# Altium schematic sheet st-link-v2.SchDoc
size C
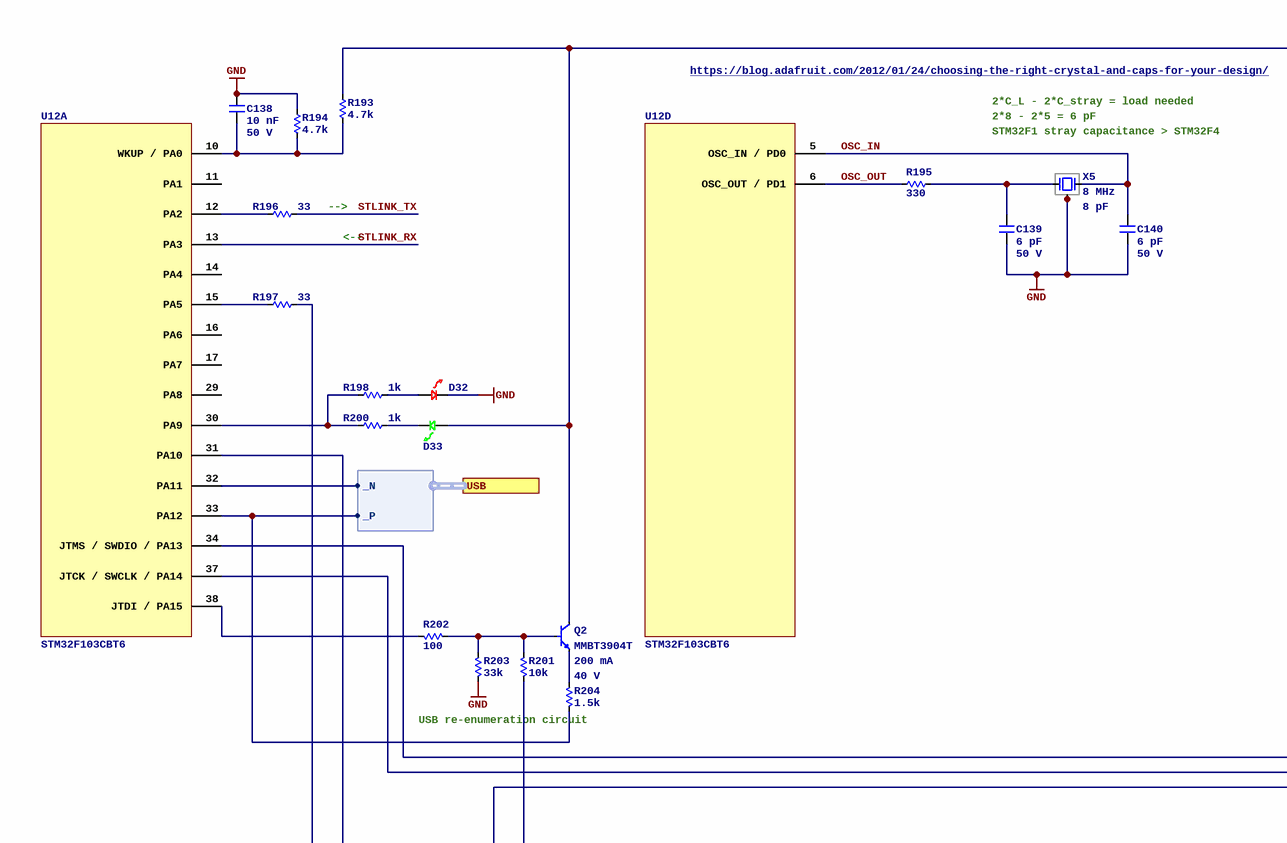
[diagram p0: st-link-v2.SchDoc, top left]
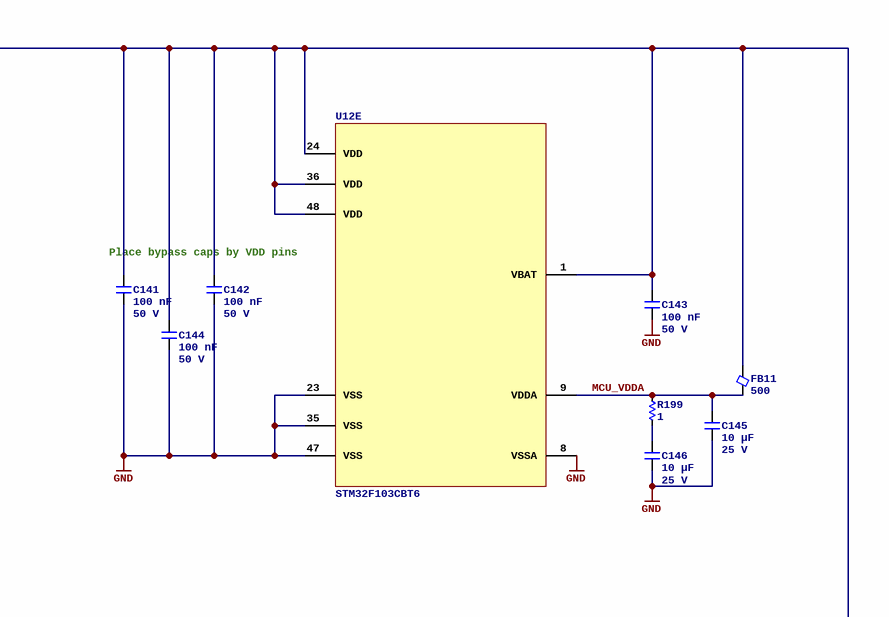
[diagram p1: st-link-v2.SchDoc, top right]
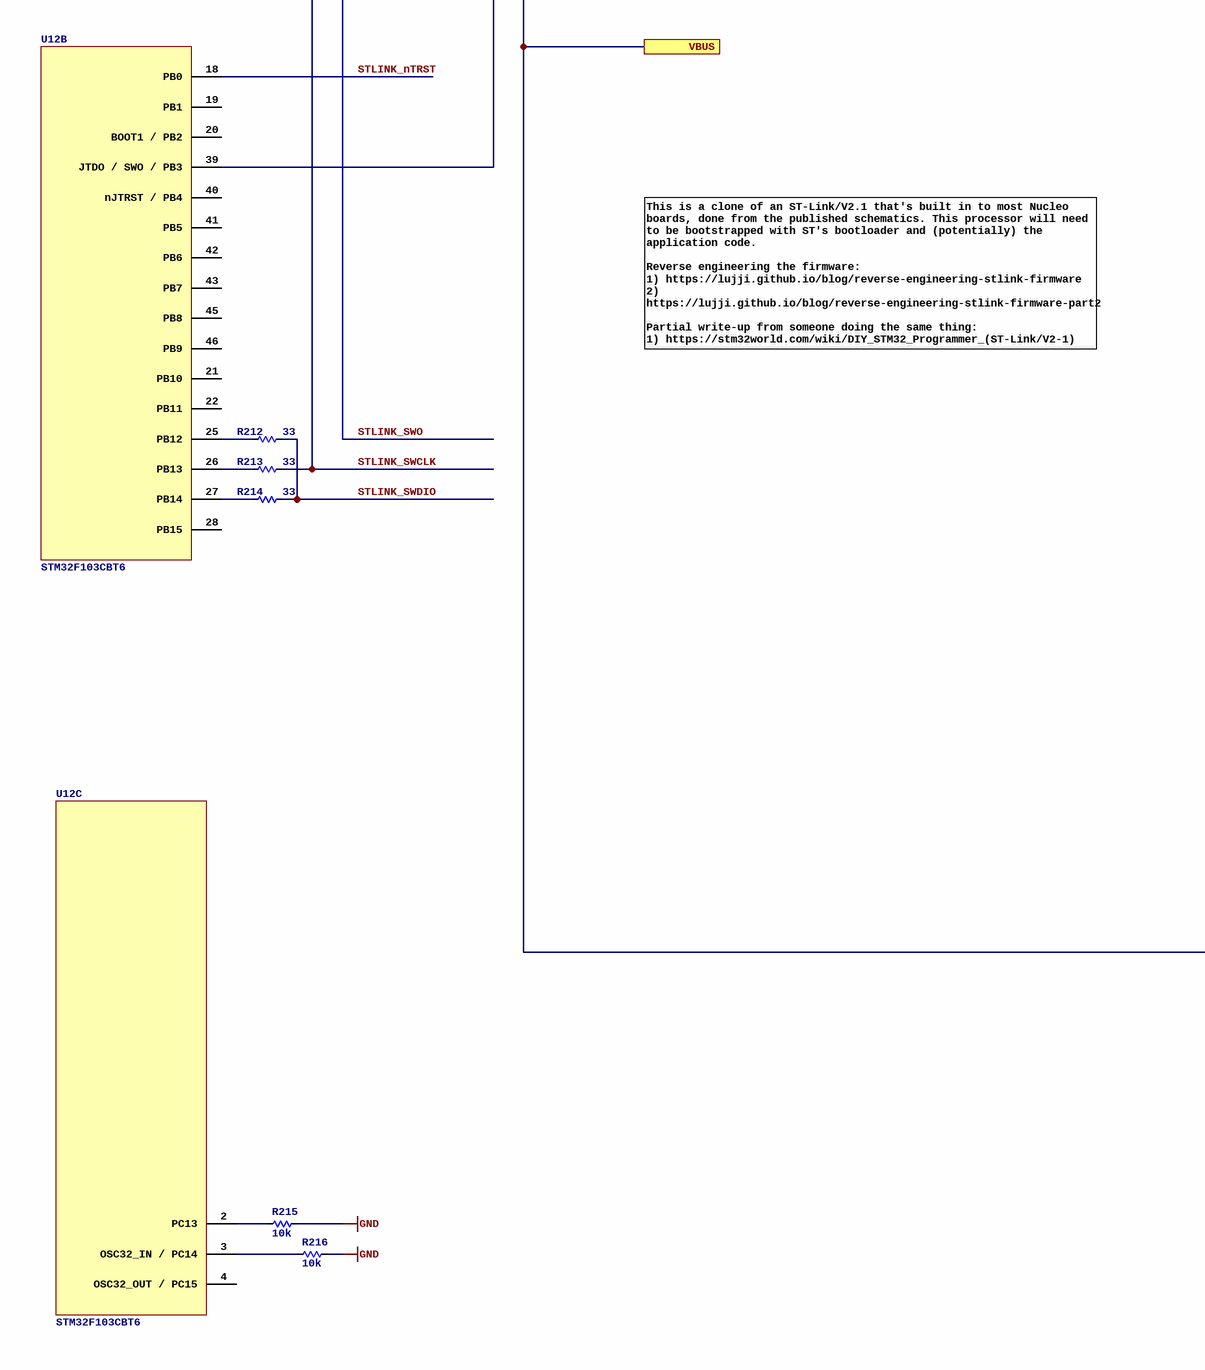
[diagram p2: st-link-v2.SchDoc, bottom left]
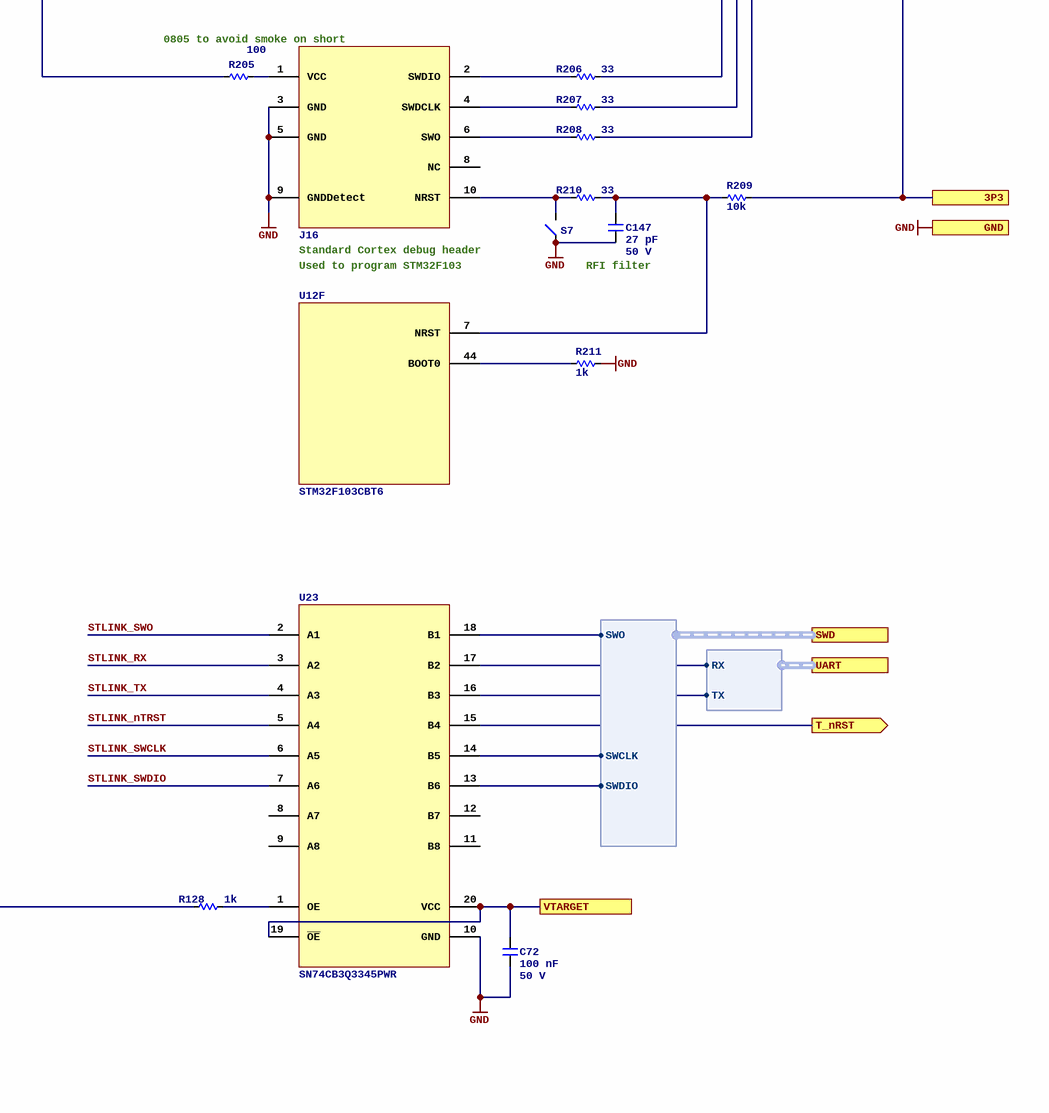
[diagram p3: st-link-v2.SchDoc, bottom right]

## Parts
C72  Capacitance: 100 nF  Voltage Rating: 50 V  [C0402]  (hidden comment: CL05B104KB54PNC)
C138  Capacitance: 10 nF  Voltage Rating: 50 V  [C0402]  (hidden comment: CL05B103KB5NNNC)
C139  Capacitance: 6 pF  Voltage Rating: 50 V  [C0402]  (hidden comment: 0402CG6R0C500NT)
C140  Capacitance: 6 pF  Voltage Rating: 50 V  [C0402]  (hidden comment: 0402CG6R0C500NT)
C141  Capacitance: 100 nF  Voltage Rating: 50 V  [C0402]  (hidden comment: CL05B104KB54PNC)
C142  Capacitance: 100 nF  Voltage Rating: 50 V  [C0402]  (hidden comment: CL05B104KB54PNC)
C143  Capacitance: 100 nF  Voltage Rating: 50 V  [C0402]  (hidden comment: CL05B104KB54PNC)
C144  Capacitance: 100 nF  Voltage Rating: 50 V  [C0402]  (hidden comment: CL05B104KB54PNC)
C145  Capacitance: 10 µF  Voltage Rating: 25 V  [C0603]  (hidden comment: CL10A106MA8NRNC)
C146  Capacitance: 10 µF  Voltage Rating: 25 V  [C0805]  (hidden comment: CL21B106KAYQNNE)
C147  Capacitance: 27 pF  Voltage Rating: 50 V  [C0402]  (hidden comment: 0402CG270J500NT)
D32  LTST-C190KRKT  [LED_0603P_RED]  (value not drawn)
D33  LTST-C190GKT  [LED_0603P_GREEN]  (value not drawn)
FB11  Current Rating (mA): 500  [FB0402]  (hidden comment: BLM15AX601SN1D)
J16  FTSH-105-01-L-DV-K  [FTSH-105-01-L-DV-K_KEYED]  (value not drawn)
Q2  MMBT3904T  Current: 200 mA  Voltage: 40 V  [3SOT523]
R128  value 1k  [R0402]  (hidden comment: 0402WGF1001TCE)
R193  value 4.7k  [R0402]  (hidden comment: 0402WGF4701TCE)
R194  value 4.7k  [R0402]  (hidden comment: 0402WGF4701TCE)
R195  value 330  [R0402]  (hidden comment: 0402WGF3300TCE)
R196  value 33  [R0402]  (hidden comment: 0402WGF330JTCE)
R197  value 33  [R0402]  (hidden comment: 0402WGF330JTCE)
R198  value 1k  [R0402]  (hidden comment: 0402WGF1001TCE)
R199  value 1  [R0402]  (hidden comment: CRCW04021R00FKED)
R200  value 1k  [R0402]  (hidden comment: 0402WGF1001TCE)
R201  value 10k  [R0402]  (hidden comment: 0402WGF1002TCE)
R202  value 100  [R0402]  (hidden comment: RC0402FR-07100RL)
R203  value 33k  [R0402]  (hidden comment: 0402WGF3302TCE)
R204  value 1.5k  [R0402]  (hidden comment: 0402WGF1501TCE)
R205  value 100  [R0805]  (hidden comment: ERJP06F1000V)
R206  value 33  [R0402]  (hidden comment: 0402WGF330JTCE)
R207  value 33  [R0402]  (hidden comment: 0402WGF330JTCE)
R208  value 33  [R0402]  (hidden comment: 0402WGF330JTCE)
R209  value 10k  [R0402]  (hidden comment: 0402WGF1002TCE)
R210  value 33  [R0402]  (hidden comment: 0402WGF330JTCE)
R211  value 1k  [R0402]  (hidden comment: 0402WGF1001TCE)
R212  value 33  [R0402]  (hidden comment: 0402WGF330JTCE)
R213  value 33  [R0402]  (hidden comment: 0402WGF330JTCE)
R214  value 33  [R0402]  (hidden comment: 0402WGF330JTCE)
R215  value 10k  [R0402]  (hidden comment: 0402WGF1002TCE)
R216  value 10k  [R0402]  (hidden comment: 0402WGF1002TCE)
S7  TS-1092S-B3D2-G  [SWITCH_TS-1092S-B3D2-G]  (value not drawn)
U12  STM32F103CBT6  [48TQFP7]  (parts A,B,C,D,E,F of 6)
U23  SN74CB3Q3345PWR  [TI_PW0020A]
X5  Frequency: 8 MHz  Capacitance: 8 pF  [4_SMD_3.2X2.5MM]  (hidden comment: ECS-80-8-33Q-JES-TR)

## Ports
3P3, GND, SWD (harness SWD), T_nRST (out), UART (harness UART), USB (harness DIFF), VBUS, VTARGET

## Harnesses
DIFF: _P, _N
SWD: SWO, SWCLK, SWDIO
UART: RX, TX

## Nets
GND: C72.2 C138.1 C139.2 C140.2 C141.2 C142.2 C143.2 C144.2 C145.2 C146.2 C147.2 D32.2 J16.3(GND) J16.5(GND) J16.9(GNDDetect) R194.2 R203.2 R211.2 R215.2 R216.2 S7.1 U12.8(VSSA) U12.23(VSS) U12.35(VSS) U12.47(VSS) U23.10(GND) X5.2 X5.4 ; port GND
3P3: C141.1 C142.1 C143.1 C144.1 D33.1 FB11.2 Q2.3(C) R193.2 R205.2 R209.1 U12.1(VBAT) U12.24(VDD) U12.36(VDD) U12.48(VDD) ; port 3P3
MCU_VDDA: C145.1 FB11.1 R199.2 U12.9(VDDA)
OSC_IN: C140.1 U12.5(OSC_IN_/_PD0) X5.3
OSC_OUT: R195.1 U12.6(OSC_OUT_/_PD1)
STLINK_nTRST: U12.18(PB0) U23.5(A4)
STLINK_RX: U12.13(PA3) U23.3(A2)
STLINK_SWCLK: R197.1 R213.1 U23.6(A5)
STLINK_SWDIO: R212.1 R214.1 U23.7(A6)
STLINK_SWO: U12.31(PA10) U23.2(A1)
STLINK_TX: R196.1 U23.4(A3)
T_nRST: U23.15(B4) ; port T_nRST
VBUS: R128.2 R201.1 ; port VBUS
VTARGET: C72.1 U23.19(~{OE}) U23.20(VCC) ; port VTARGET
NetC138_2: C138.2 R193.1 R194.1 U12.10(WKUP_/_PA0)
NetC139_1: C139.1 R195.2 X5.1
NetC146_1: C146.1 R199.1
NetC147_1: C147.1 R209.2 R210.1 U12.7(NRST)
NetD32_1: D32.1 R198.1
NetD33_2: D33.2 R200.1
NetJ16_1: J16.1(VCC) R205.1
NetJ16_2: J16.2(SWDIO) R206.2
NetJ16_4: J16.4(SWDCLK) R207.2
NetJ16_6: J16.6(SWO) R208.2
NetJ16_10: J16.10(NRST) R210.2 S7.2
NetQ2_1: Q2.1(B) R201.2 R202.1 R203.1
NetQ2_2: Q2.2(E) R204.1
NetR128_1: R128.1 U23.1(OE)
NetR196_2: R196.2 U12.12(PA2)
NetR197_2: R197.2 U12.15(PA5)
NetR198_2: R198.2 R200.2 U12.30(PA9)
NetR202_2: R202.2 U12.38(JTDI_/_PA15)
NetR204_2: R204.2 U12.33(PA12) ; port USB._P
NetR206_1: R206.1 U12.34(JTMS_/_SWDIO_/_PA13)
NetR207_1: R207.1 U12.37(JTCK_/_SWCLK_/_PA14)
NetR208_1: R208.1 U12.39(JTDO_/_SWO_/_PB3)
NetR211_1: R211.1 U12.44(BOOT0)
NetR212_2: R212.2 U12.25(PB12)
NetR213_2: R213.2 U12.26(PB13)
NetR214_2: R214.2 U12.27(PB14)
NetR215_1: R215.1 U12.2(PC13)
NetR216_1: R216.1 U12.3(OSC32_IN_/_PC14)
NetU12_32: U12.32(PA11) ; port USB._N
NetU23_13: U23.13(B6) ; port SWD.SWDIO
NetU23_14: U23.14(B5) ; port SWD.SWCLK
NetU23_16: U23.16(B3) ; port UART.TX
NetU23_17: U23.17(B2) ; port UART.RX
NetU23_18: U23.18(B1) ; port SWD.SWO

Not connected (* = marked no-connect by the designer): J16 8(NC); U12 4(OSC32_OUT_/_PC15) 11(PA1) 14(PA4) 16(PA6) 17(PA7) 19(PB1) 20(BOOT1_/_PB2) 21(PB10) 22(PB11) 28(PB15) 29(PA8) 40(nJTRST_/_PB4) 41(PB5) 42(PB6) 43(PB7) 45(PB8) 46(PB9); U23 8(A7) 9(A8) 11(B8) 12(B7)

## Notes on the sheet
- https://blog.adafruit.com/2012/01/24/choosing-the-right-crystal-and-caps-for-your-design/
- 2*C_L - 2*C_stray = load needed
- 2*8 - 2*5 = 6 pF
- (near X5) STM32F1 stray capacitance > STM32F4
- (near R196) -->
- (near R196) <--
- Place bypass caps by VDD pins
- (near R204) USB re-enumeration circuit
- 0805 to avoid smoke on short
- Standard Cortex debug header
- This is a clone of an ST-Link/V2.1 that's built in to most Nucleo boards, done from the published schematics. This processor will need to be bootstrapped with ST's bootloader and (potentially) the application code.
  Reverse engineering the firmware:
  1) https://lujji.github.io/blog/reverse-engineering-stlink-firmware
  2) https://lujji.github.io/blog/reverse-engineering-stlink-firmware-part2
  Partial write-up from someone doing the same thing:
  1) https://stm32world.com/wiki/DIY_STM32_Programmer_(ST-Link/V2-1)
- Used to program STM32F103
- RFI filter

## Library data of the parts
C72 C141-C144 = CL05B104KB54PNC: Manufacturer: Samsung Electro-Mechanics; Dielectric: X7R; ComponentLink1URL: https://wmsc.lcsc.com/wmsc/upload/file/pdf/v2/lcsc/2304140030_Samsung-Electro-Mechanics-CL05B104KB54PNC_C307331.pdf; ComponentLink1Description: Datasheet; Manufacturer Part Number: CL05B104KB54PNC; Package: 0402; Supplier 2: LCSC; Supplier Part Number 2: C307331
C138 = CL05B103KB5NNNC: Manufacturer: Samsung Electro-Mechanics; Dielectric: X7R; ComponentLink1URL: https://wmsc.lcsc.com/wmsc/upload/file/pdf/v2/lcsc/2304140030_Samsung-Electro-Mechanics-CL05B103KB5NNNC_C15195.pdf; ComponentLink1Description: Datasheet; Manufacturer Part Number: CL05B103KB5NNNC; Package: 0402; Supplier 2: LCSC; Supplier Part Number 2: C15195
C139 C140 = 0402CG6R0C500NT: Manufacturer: FH(Guangdong Fenghua Advanced Tech); Dielectric: C0G; ComponentLink1URL: https://wmsc.lcsc.com/wmsc/upload/file/pdf/v2/lcsc/2304140030_FH--Guangdong-Fenghua-Advanced-Tech-0402CG6R0C500NT_C1575.pdf; ComponentLink1Description: Datasheet; Manufacturer Part Number: 0402CG6R0C500NT; Package: 0402; Supplier 2: LCSC; Supplier Part Number 2: C1575
C145 = CL10A106MA8NRNC: Manufacturer: Samsung Electro-Mechanics; Dielectric: X5R; ComponentLink1URL: https://wmsc.lcsc.com/wmsc/upload/file/pdf/v2/lcsc/2304140030_Samsung-Electro-Mechanics-CL10A106MA8NRNC_C96446.pdf; ComponentLink1Description: Datasheet; Manufacturer Part Number: CL10A106MA8NRNC; Package: 0603; Supplier 2: LCSC; Supplier Part Number 2: C96446
C146 = CL21B106KAYQNNE: Manufacturer: Samsung Electro-Mechanics; Dielectric: X7R; ComponentLink1URL: https://datasheet.lcsc.com/lcsc/2206222030_Samsung-Electro-Mechanics-CL21B106KAYQNNE_C3039694.pdf; ComponentLink1Description: Datasheet; Manufacturer Part Number: CL21B106KAYQNNE; Package: 0805; Supplier 2: LCSC; Supplier Part Number 2: C3039694
C147 = 0402CG270J500NT: Manufacturer: FH(Guangdong Fenghua Advanced Tech); Dielectric: C0G; ComponentLink1URL: https://wmsc.lcsc.com/wmsc/upload/file/pdf/v2/lcsc/2304140030_FH--Guangdong-Fenghua-Advanced-Tech-0402CG270J500NT_C1557.pdf; ComponentLink1Description: Datasheet; Manufacturer Part Number: 0402CG270J500NT; Package: 0402; Supplier 2: LCSC; Supplier Part Number 2: C1557
D32 = LTST-C190KRKT: LED SUPER RED CLEAR 0603 SMD; Manufacturer: Lite-On Inc; Vf: 2.0 V; If: 20 mA; ComponentLink1URL: https://optoelectronics.liteon.com/upload/download/DS-22-99-0151/LTST-C190KRKT.pdf; ComponentLink1Description: Datasheet; Supplier 1: DigiKey; Supplier Part Number 1: 160-1436-1-ND; Manufacturer Part Number: LTST-C190KRKT; Supplier 2: LCSC; Supplier Part Number 2: C94869; LED Color: Red; Supplier 3: Mouser; Supplier Part Number 3: 859-LTST-C190KRKT
D33 = LTST-C190GKT: LED GREEN CLEAR 0603 SMD; Manufacturer: Lite-On Inc; Vf: 2.0 V; If: 20 mA; Supplier 1: DigiKey; ComponentLink1URL: https://mm.digikey.com/Volume0/opasdata/d220001/medias/docus/858/LTST-C190GKT.pdf; ComponentLink1Description: Datasheet; Supplier Part Number 1: 160-1183-1-ND; Manufacturer Part Number: LTST-C190GKT; Supplier 2: LCSC; Supplier Part Number 2: C125093; LED Color: Green; Supplier 3: Mouser; Supplier Part Number 3: 859-LTST-C190GKT
FB11 = BLM15AX601SN1D: Manufacturer: Murata Electronics; Z @ 100 MHz: 600; DCR (mOhms): 340; ComponentLink1URL: https://wmsc.lcsc.com/wmsc/upload/file/pdf/v2/lcsc/2304140030_Murata-Electronics-BLM15AX601SN1D_C76886.pdf; ComponentLink1Description: Datasheet; Manufacturer Part Number: BLM15AX601SN1D; Supplier 2: LCSC; Supplier Part Number 2: C76886; Package: 0402
J16 = FTSH-105-01-L-DV-K: CONN HEADER 10 POS DUAL .05" SMD; Manufacturer: Samtec Inc; Supplier 1: DigiKey; ComponentLink1URL: http://www.samtec.com/documents/webfiles/cpdf/FTSH-1XX-XX-XXX-DV-XXX-MKT.pdf; ComponentLink1Description: Datasheet; Supplier Part Number 1: FTSH-105-01-L-DV-K-ND; Manufacturer Part Number: FTSH-105-01-L-DV-K; Supplier 2: LCSC; Supplier Part Number 2: C448647; Supplier 3: Mouser; Supplier Part Number 3: 200-FTSH10501LDVK
Q2 = MMBT3904T: Bipolar (BJT) Transistor NPN 40 V 200 mA 300MHz 150 mW Surface Mount SOT-523; Manufacturer: Shenzhen Slkormicro Semicon Co., Ltd.; Supplier 1: DigiKey; Supplier Part Number 1: 5399-MMBT3904TCT-ND; Manufacturer Part Number: MMBT3904T; ComponentLink1Description: Datasheet; ComponentLink1URL: https://mm.digikey.com/Volume0/opasdata/d220001/medias/docus/7136/5399_MMBT3904T%20SOT-523.pdf; Supplier 2: LCSC; Supplier Part Number 2: C61616; Polarity: NPN
R128 R198 R200 R211 = 0402WGF1001TCE: Manufacturer: UNI-ROYAL(Uniroyal Elec); Tolerance: 1%; Temperature Coefficient: ±100ppm/?; Power Rating (mW): 62.5; ComponentLink1Description: Datasheet; ComponentLink1URL: https://wmsc.lcsc.com/wmsc/upload/file/pdf/v2/lcsc/2206010216_UNI-ROYAL-Uniroyal-Elec-0402WGF1001TCE_C11702.pdf; Manufacturer Part Number: 0402WGF1001TCE; Package: 0402; Supplier 2: LCSC; Supplier Part Number 2: C11702
R193 R194 = 0402WGF4701TCE: Manufacturer: UNI-ROYAL(Uniroyal Elec); Tolerance: 1%; Temperature Coefficient: ±100ppm/?; Power Rating (mW): 62.5; ComponentLink1Description: Datasheet; ComponentLink1URL: https://wmsc.lcsc.com/wmsc/upload/file/pdf/v2/lcsc/2206010045_UNI-ROYAL-Uniroyal-Elec-0402WGF4701TCE_C25900.pdf; Manufacturer Part Number: 0402WGF4701TCE; Package: 0402; Supplier 2: LCSC; Supplier Part Number 2: C25900
R195 = 0402WGF3300TCE: Manufacturer: UNI-ROYAL(Uniroyal Elec); Tolerance: 1%; Temperature Coefficient: ±100ppm/?; Power Rating (mW): 62.5; ComponentLink1Description: Datasheet; ComponentLink1URL: https://wmsc.lcsc.com/wmsc/upload/file/pdf/v2/lcsc/2205311900_UNI-ROYAL-Uniroyal-Elec-0402WGF3300TCE_C25104.pdf; Manufacturer Part Number: 0402WGF3300TCE; Package: 0402; Supplier 2: LCSC; Supplier Part Number 2: C25104
R196 R197 R206-R208 R210 R212-R214 = 0402WGF330JTCE: Manufacturer: UNI-ROYAL(Uniroyal Elec); Tolerance: 1%; Temperature Coefficient: ±100ppm/?; Power Rating (mW): 62.5; ComponentLink1Description: Datasheet; ComponentLink1URL: https://wmsc.lcsc.com/wmsc/upload/file/pdf/v2/lcsc/2205311900_UNI-ROYAL-Uniroyal-Elec-0402WGF330JTCE_C25105.pdf; Manufacturer Part Number: 0402WGF330JTCE; Package: 0402; Supplier 2: LCSC; Supplier Part Number 2: C25105
R199 = CRCW04021R00FKED: Manufacturer: Vishay Intertech; Tolerance: 1%; Temperature Coefficient: ±100ppm/?; Power Rating (mW): 63; ComponentLink1Description: Datasheet; ComponentLink1URL: https://wmsc.lcsc.com/wmsc/upload/file/pdf/v2/lcsc/2211030200_Vishay-Intertech-CRCW04021R00FKED_C482087.pdf; Manufacturer Part Number: CRCW04021R00FKED; Package: 0402; Supplier 2: LCSC; Supplier Part Number 2: C482087
R201 R209 R215 R216 = 0402WGF1002TCE: Manufacturer: UNI-ROYAL(Uniroyal Elec); Tolerance: 1%; Temperature Coefficient: ±100ppm/?; Power Rating (mW): 62.5; ComponentLink1Description: Datasheet; ComponentLink1URL: https://wmsc.lcsc.com/wmsc/upload/file/pdf/v2/lcsc/2206010100_UNI-ROYAL-Uniroyal-Elec-0402WGF1002TCE_C25744.pdf; Manufacturer Part Number: 0402WGF1002TCE; Package: 0402; Supplier 2: LCSC; Supplier Part Number 2: C25744
R202 = RC0402FR-07100RL: Manufacturer: YAGEO; Tolerance: 1%; Temperature Coefficient: ±100ppm/?; Power Rating (mW): 62.5; ComponentLink1Description: Datasheet; ComponentLink1URL: https://wmsc.lcsc.com/wmsc/upload/file/pdf/v2/lcsc/2304140030_YAGEO-RC0402FR-07100RL_C106232.pdf; Manufacturer Part Number: RC0402FR-07100RL; Package: 0402; Supplier 2: LCSC; Supplier Part Number 2: C106232
R203 = 0402WGF3302TCE: Manufacturer: UNI-ROYAL(Uniroyal Elec); Tolerance: 1%; Temperature Coefficient: ±100ppm/?; Power Rating (mW): 62.5; ComponentLink1Description: Datasheet; ComponentLink1URL: https://wmsc.lcsc.com/wmsc/upload/file/pdf/v2/lcsc/2206010100_UNI-ROYAL-Uniroyal-Elec-0402WGF3302TCE_C25779.pdf; Manufacturer Part Number: 0402WGF3302TCE; Package: 0402; Supplier 2: LCSC; Supplier Part Number 2: C25779
R204 = 0402WGF1501TCE: Manufacturer: UNI-ROYAL(Uniroyal Elec); Tolerance: 1%; Temperature Coefficient: ±100ppm/?; Power Rating (mW): 62.5; ComponentLink1Description: Datasheet; ComponentLink1URL: https://wmsc.lcsc.com/wmsc/upload/file/pdf/v2/lcsc/2206010045_UNI-ROYAL-Uniroyal-Elec-0402WGF1501TCE_C25867.pdf; Manufacturer Part Number: 0402WGF1501TCE; Package: 0402; Supplier 2: LCSC; Supplier Part Number 2: C25867
R205 = ERJP06F1000V: Manufacturer: PANASONIC; Tolerance: 1%; Temperature Coefficient: ±100ppm/?; Power Rating (mW): 500; ComponentLink1Description: Datasheet; ComponentLink1URL: https://wmsc.lcsc.com/wmsc/upload/file/pdf/v2/lcsc/2404150944_PANASONIC-ERJP06F1000V_C441975.pdf; Manufacturer Part Number: ERJP06F1000V; Package: 0805; Supplier 2: LCSC; Supplier Part Number 2: C441975
S7 = TS-1092S-B3D2-G: SWITCH TACTILE SPST-NO; Manufacturer: Yuandi; Manufacturer Part Number: TS-1092S-B3D2-G; ComponentLink1Description: Datasheet; ComponentLink1URL: https://www.lcsc.com/datasheet/lcsc_datasheet_2005071437_Yuandi-TS-1092S-B3D2-G_C520860.pdf; Supplier 2: LCSC; Supplier Part Number 2: C520860
U12 = STM32F103CBT6: ARM Cortex-M3 STM32 F1 Microcontroller 32-Bit 72MHz 128kB FLASH LQFP48 STM32F103CBT6; Manufacturer: STMicroelectronics; Supplier 1: DigiKey; Supplier Part Number 1: 497-6288-ND; Manufacturer Part Number: STM32F103CBT6; ComponentLink1Description: Datasheet; ComponentLink1URL: https://www.st.com/resource/en/datasheet/stm32f103cb.pdf; ComponentLink2Description: Reference Manual; ComponentLink2URL: https://www.st.com/resource/en/reference_manual/rm0008-stm32f101xx-stm32f102xx-stm32f103xx-stm32f105xx-and-stm32f107xx-advanced-armbased-32bit-mcus-stmicroelectronics.pdf; Supplier 2: LCSC; Supplier Part Number 2: C8304; Supplier 3: Mouser; Supplier Part Number 3: 511-STM32F103CBT6
U23 = SN74CB3Q3345PWR: Low-voltage high-bandwidth bus switch; Manufacturer: Texas Instruments; Manufacturer Part Number: SN74CB3Q3345PWR; Supplier 1: DigiKey; Supplier Part Number 1: 296-19141-1-ND; Supplier 2: LCSC; Supplier Part Number 2: C2674539; ComponentLink1Description: Datasheet; ComponentLink1URL: https://www.ti.com/lit/ds/symlink/sn74cb3q3345.pdf; Supplier 3: Mouser; Supplier Part Number 3: 595-SN74CB3Q3345PWR
X5 = ECS-80-8-33Q-JES-TR: 8 MHz ±20ppm Crystal 8pF 500 Ohms 4-SMD, No Lead; Manufacturer: ECS Inc.; Supplier 1: DigiKey; Supplier Part Number 1: 50-ECS-80-8-33Q-JES-TRCT-ND; Manufacturer Part Number: ECS-80-8-33Q-JES-TR; Supplier 2: LCSC; Supplier Part Number 2: C5727442; ComponentLink1Description: Datasheet; ComponentLink1URL: https://ecsxtal.com/store/pdf/ECX-33Q.pdf; Supplier 3: Mouser; Supplier Part Number 3: 520-ECS-80-833QJESTR